# Altium schematic sheet Sensor Suite.SchDoc
size A4; SheetNumber: 1; SheetTotal: 2
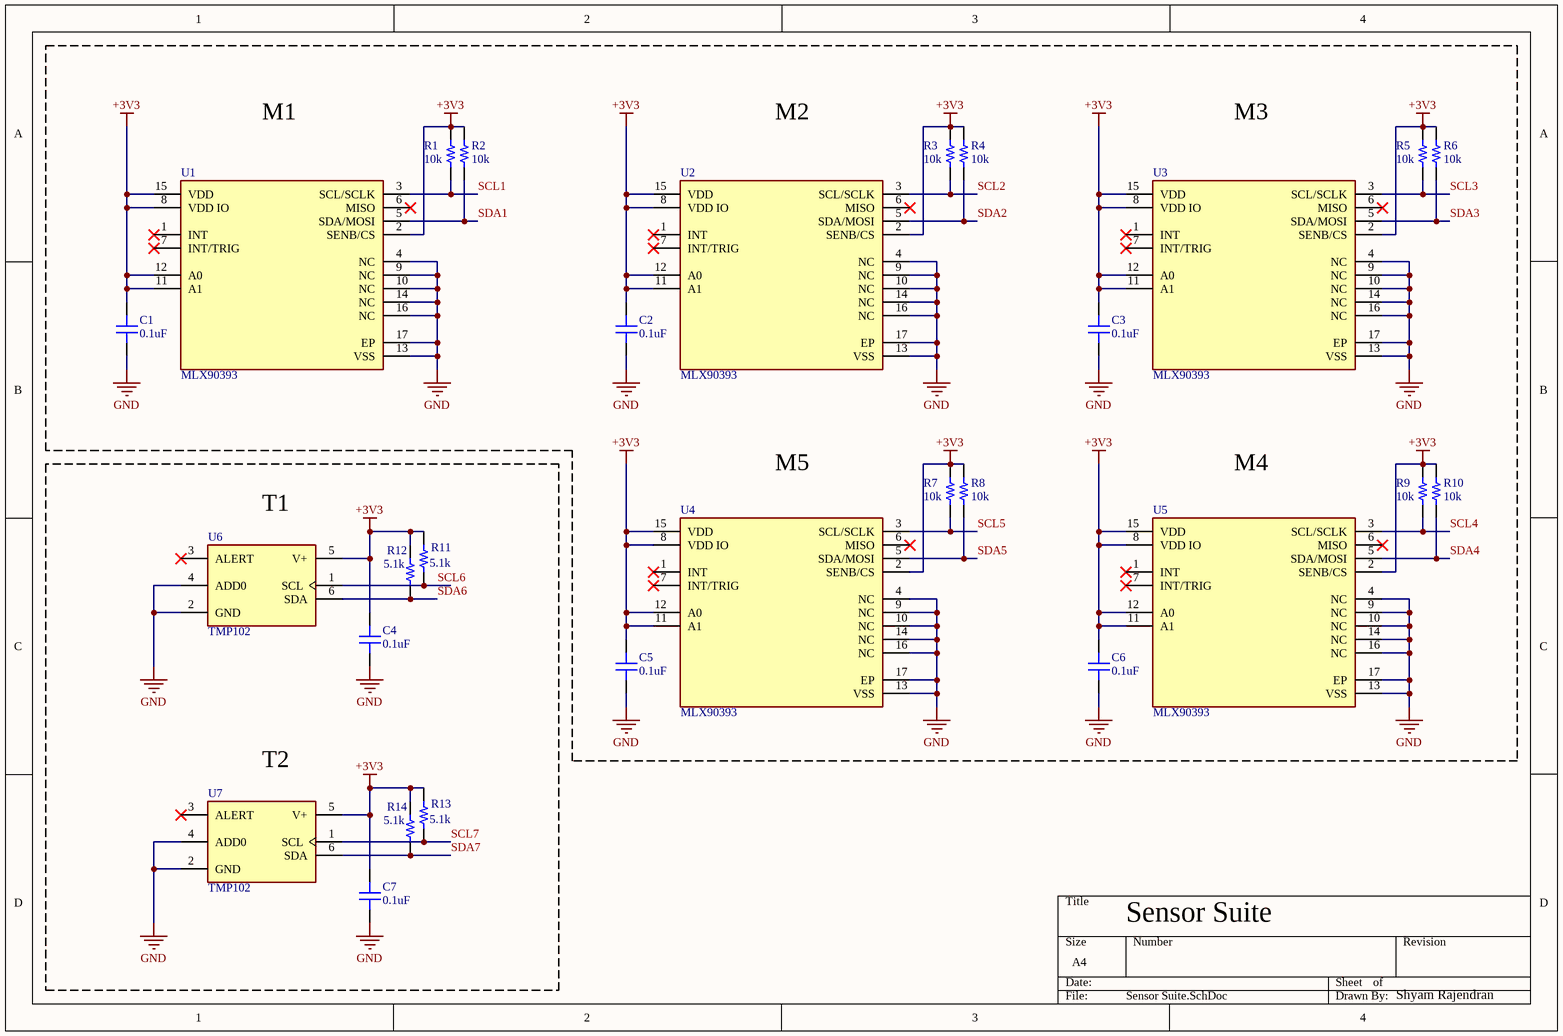
[diagram p0: Sensor Suite.SchDoc]

## Parts
C1  Capacitance: 0.1uF  [CAP 0603_1608]  (hidden comment: 10uF)
C2  Capacitance: 0.1uF  [CAP 0603_1608]  (hidden comment: 10uF)
C3  Capacitance: 0.1uF  [CAP 0603_1608]  (hidden comment: 10uF)
C4  Capacitance: 0.1uF  [CAP 0603_1608]  (hidden comment: 10uF)
C5  Capacitance: 0.1uF  [CAP 0603_1608]  (hidden comment: 10uF)
C6  Capacitance: 0.1uF  [CAP 0603_1608]  (hidden comment: 10uF)
C7  Capacitance: 0.1uF  [CAP 0603_1608]  (hidden comment: 10uF)
R1  10k  [RES 0603_1608]
R2  10k  [RES 0603_1608]
R3  10k  [RES 0603_1608]
R4  10k  [RES 0603_1608]
R5  10k  [RES 0603_1608]
R6  10k  [RES 0603_1608]
R7  10k  [RES 0603_1608]
R8  10k  [RES 0603_1608]
R9  10k  [RES 0603_1608]
R10  10k  [RES 0603_1608]
R11  5.1K  [RES 0603_1608]
R12  5.1K  [RES 0603_1608]
R13  5.1K  [RES 0603_1608]
R14  5.1K  [RES 0603_1608]
U1  MLX90393  [MLX90393]
U2  MLX90393  [MLX90393]
U3  MLX90393  [MLX90393]
U4  MLX90393  [MLX90393]
U5  MLX90393  [MLX90393]
U6  TMP102  [TMP102]
U7  TMP102  [TMP102]

## Nets
+3V3: C1.2 C2.2 C3.2 C4.2 C5.2 C6.2 C7.2 R1.2 R2.2 R3.2 R4.2 R5.2 R6.2 R7.2 R8.2 R9.2 R10.2 R11.1 R12.1 R13.1 R14.1 U1.2(SENB/CS) U1.8(VDD_IO) U1.11(A1) U1.12(A0) U1.15(VDD) U2.2(SENB/CS) U2.8(VDD_IO) U2.11(A1) U2.12(A0) U2.15(VDD) U3.2(SENB/CS) U3.8(VDD_IO) U3.11(A1) U3.12(A0) U3.15(VDD) U4.2(SENB/CS) U4.8(VDD_IO) U4.11(A1) U4.12(A0) U4.15(VDD) U5.2(SENB/CS) U5.8(VDD_IO) U5.11(A1) U5.12(A0) U5.15(VDD) U6.5(V+) U7.5(V+)
GND: C1.1 C2.1 C3.1 C4.1 C5.1 C6.1 C7.1 U1.4(NC) U1.9(NC) U1.10(NC) U1.13(VSS) U1.14(NC) U1.16(NC) U1.17(EP) U2.4(NC) U2.9(NC) U2.10(NC) U2.13(VSS) U2.14(NC) U2.16(NC) U2.17(EP) U3.4(NC) U3.9(NC) U3.10(NC) U3.13(VSS) U3.14(NC) U3.16(NC) U3.17(EP) U4.4(NC) U4.9(NC) U4.10(NC) U4.13(VSS) U4.14(NC) U4.16(NC) U4.17(EP) U5.4(NC) U5.9(NC) U5.10(NC) U5.13(VSS) U5.14(NC) U5.16(NC) U5.17(EP) U6.2(GND) U6.4(ADD0) U7.2(GND) U7.4(ADD0)
SCL1: R1.1 U1.3(SCL/SCLK)
SCL2: R3.1 U2.3(SCL/SCLK)
SCL3: R5.1 U3.3(SCL/SCLK)
SCL4: R9.1 U5.3(SCL/SCLK)
SCL5: R7.1 U4.3(SCL/SCLK)
SCL6: R11.2 U6.1(SCL)
SCL7: R13.2 U7.1(SCL)
SDA1: R2.1 U1.5(SDA/MOSI)
SDA2: R4.1 U2.5(SDA/MOSI)
SDA3: R6.1 U3.5(SDA/MOSI)
SDA4: R10.1 U5.5(SDA/MOSI)
SDA5: R8.1 U4.5(SDA/MOSI)
SDA6: R12.2 U6.6(SDA)
SDA7: R14.2 U7.6(SDA)

Not connected (* = marked no-connect by the designer): U1 1(INT)* 6(MISO)* 7(INT/TRIG)*; U2 1(INT)* 6(MISO)* 7(INT/TRIG)*; U3 1(INT)* 6(MISO)* 7(INT/TRIG)*; U4 1(INT)* 6(MISO)* 7(INT/TRIG)*; U5 1(INT)* 6(MISO)* 7(INT/TRIG)*; U6 3(ALERT)*; U7 3(ALERT)*

## Notes on the sheet
- M1
- M2
- M3
- (near U6) T1
- M5
- M4
- (near U7) T2
- Sensor Suite
- Shyam Rajendran

## Library data of the parts
C1-C7 = GCJ188C70J335KE02D: 0603; manufacturer: Murata Electronics; Temperature Coefficient: X7S; Tolerance: ±10%; value: 3.3 µF; Voltage - Rated: 6.3V; Part Number: GCJ188C70J335KE02D; Applications: Automotive, Boardflex Sensitive; componentlink1description: Datasheet; componentlink1url: https://search.murata.co.jp/Ceramy/image/img/A01X/G101/ENG/GCJ188C70J335KE02-01A.pdf; componentlink2description: DigiKey Link; componentlink2url: https://www.digikey.com/en/products/detail/murata-electronics/GCJ188C70J335KE02D/10696585; Device Package: 0603 (1608 Metric); Features: Soft Termination; lastupdated: 09-02-2024 20:08:53; Lifecycle Status: Active; Minimum Order: 1; Mounting Type: Surface Mount, MLCC; Operating Temperature: -55°C ~ 125°C; Package / Case: 0603 (1608 Metric); packaging: TapeAndReel; partid: 55427; Part Status: Active; price: 0.04; Ratings: AEC-Q200; series: GCJ; Size / Dimension: 0.063" L x 0.031" W (1.60mm x 0.80mm); Supplier 1: DigiKey; Supplier Part Number 1: 490-GCJ188C70J335KE02DCT-ND; Thickness (Max): 0.039" (1.00mm)
R1-R10 = RNCS0603BKE10K0: RES 10K OHM 0.1% 1/16W 0603; Manufacturer: Stackpole Electronics Inc; Power (Watts): 0.063W, 1/16W; Resistance: 10 kOhms; Temperature Coefficient: ±25ppm/°C; Part Number: RNCS0603BKE10K0; Value: 10k; ComponentLink1Description: Datasheet; ComponentLink1URL: https://www.seielect.com/catalog/sei-rncs_rnch.pdf; ComponentLink2Description: DigiKey Link; ComponentLink2URL: https://www.digikey.com/en/products/detail/stackpole-electronics-inc/RNCS0603BKE10K0/1708836; Composition: Thin Film; Device Package: 0603 (1608 Metric); Features: Anti-Corrosive, Automotive AEC-Q200, Moisture Resistant; Height - Seated (Max): 0.022" (0.55mm); LastUpdated: 09-02-2024 20:43:37; Lifecycle Status: Active; Minimum Order: 1; Number of Terminations: 2; Operating Temperature: -55°C ~ 155°C; Package / Case: 0603 (1608 Metric); Packaging: TapeAndReel; PartId: 4838; Part Status: Active; Price: 0.06; Ratings: AEC-Q200; Series: RNCS; Size / Dimension: 0.061" L x 0.031" W (1.55mm x 0.80mm); Supplier 1: DigiKey; Supplier Part Number 1: RNCS0603BKE10K0CT-ND; Supplier Device Package: 0603; Tolerance: ±0.1%
R11-R14 = RNCS0603BKE10K0: 0603; Manufacturer: Stackpole Electronics Inc; Power (Watts): 0.063W, 1/16W; Resistance: 10 kOhms; Temperature Coefficient: ±25ppm/°C; Tolerance: ±0.1%; Part Number: RNCS0603BKE10K0; Value: 5.1k; ComponentLink1Description: Datasheet; ComponentLink1URL: https://www.seielect.com/catalog/sei-rncs_rnch.pdf; ComponentLink2Description: DigiKey Link; ComponentLink2URL: https://www.digikey.com/en/products/detail/stackpole-electronics-inc/RNCS0603BKE10K0/1708836; Composition: Thin Film; Device Package: 0603 (1608 Metric); Features: Anti-Corrosive, Automotive AEC-Q200, Moisture Resistant; Height - Seated (Max): 0.022" (0.55mm); LastUpdated: 09-02-2024 20:43:37; Lifecycle Status: Active; Minimum Order: 1; Number of Terminations: 2; Operating Temperature: -55°C ~ 155°C; Package / Case: 0603 (1608 Metric); Packaging: TapeAndReel; PartId: 4838; Part Status: Active; Price: 0.06; Ratings: AEC-Q200; Series: RNCS; Size / Dimension: 0.061" L x 0.031" W (1.55mm x 0.80mm); Supplier 1: DigiKey; Supplier Part Number 1: RNCS0603BKE10K0CT-ND; Supplier Device Package: 0603
U1-U5 = MLX90393ELW-ABA-011-RE: Analog Circuit, 1 Func; Manufacturer: Melexis; Channels: 1; Max Supply Voltage: 3.6V; Min Supply Voltage: 2.2V; Nominal Supply Voltage: 3V; Supplier: Digikey; Supplier Part Number: MLX90393ELW-ABA-011-RECT-ND; Manufacturer Part Number: MLX90393ELW-ABA-011-RE; RoHS: Yes; Category: Magnetic Sensors; Stock: 37550; Pricing: 1=2.21, 5=1.964, 10=1.872, 25=1.7632, 50=1.689, 100=1.6211, 500=1.48448, 1000=1.43365 (USD); Case/Package: VQCCN; Pins: 16; Package Shape: Square; Terminal Finish: Tin; Min Operating Temperature: -40°C; Max Operating Temperature: 85°C; Throw Configuration: ANALOG CIRCUIT; JESD-30 Code: S-XQCC-N16; Package Style: CHIP CARRIER, VERY THIN PROFILEMeter; Surface Mount: Yes; Terminal Form: No Lead; Terminal Position: QUAD; Length: 3mm; Width: 3mm; Height - Seated (Max): 1mm; Terminal Pitch: 0.5mm; Temperature Grade: INDUSTRIAL; Reach SVHC Compliant: Yes; RoHS Compliant: Yes; ComponentLink1URL: https://datasheet.ciiva.com:443/pdfs/VipMasterIC/IC/MELE/MELE-S-A0009883443/MELE-S-A0009883443-1.pdf?src-supplier=IHS+Markit; ComponentLink1Description: https://datasheet.ciiva.com:443/pdfs/VipMasterIC/IC/MELE/MELE-S-A0009883443/MELE-S-A0009883443-1.pdf?src-supplier=IHS+Markit; ComponentLink2URL: https://www.melexis.com/-/media/files/documents/application-notes/mlx90393-application-note-melexis.pdf?src-supplier=Digikey; ComponentLink2Description: https://www.melexis.com/-/media/files/documents/application-notes/mlx90393-application-note-melexis.pdf?src-supplier=Digikey; ComponentLink3URL: https://www.melexis.com/-/media/files/documents/datasheets/mlx90393-datasheet-melexis.pdf?src-supplier=Digikey; ComponentLink3Description: https://www.melexis.com/-/media/files/documents/datasheets/mlx90393-datasheet-melexis.pdf?src-supplier=Digikey; ComponentLink4URL: https://datasheet.octopart.com/MLX90393ELW-ABA-011-RE-Melexis-datasheet-62983775.pdf?src-supplier=Future+Electronics; ComponentLink4Description: https://datasheet.octopart.com/MLX90393ELW-ABA-011-RE-Melexis-datasheet-62983775.pdf?src-supplier=Future+Electronics
U6 U7 = TMP102: SENSOR DIGITAL -40C-125C SOT563; Number of Bits: 12; Output Current: 3mA; Max Supply Voltage: 3.6V; Min Supply Voltage: 1.4V; Nominal Supply Current: 85uA; Operating Supply Current: 1uA; Resolution: 12b; Interface: I2C; Quiescent Current: 10uA; Lead Free: Lead Free; RoHS Compliant: Yes; Package Quantity: 4000; Weight: 9.9E-05oz; Series: -; Output Type: Digital; Radiation Hardening: No; Max Operating Temperature: 125°C; Case/Package: SOT-563; REACH SVHC: No SVHC; Number of Pins: 6; Supply Current: 85uA; Max Supply Voltage (DC): 3.6V; Min Supply Voltage (DC): 1.4V; Mount: Surface Mount; Min Operating Temperature: -40°C; Packaging: Tape and Reel